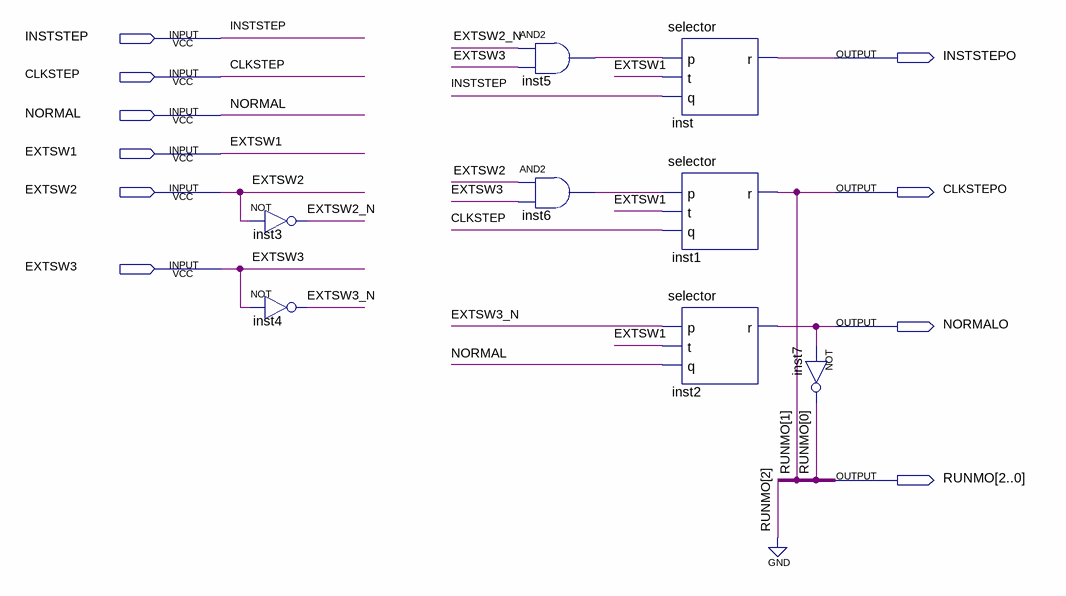
[diagram p0: schematic sheet]
// Quartus schematic runmode_ext.bdf as structural Verilog: 8 symbols, 10 pins
module runmode_ext (
  input  INSTSTEP,
  input  CLKSTEP,
  input  NORMAL,
  input  EXTSW1,
  input  EXTSW2,
  input  EXTSW3,
  output INSTSTEPO,
  output CLKSTEPO,
  output NORMALO,
  output [2:0] RUNMO
);

  wire EXTSW2_N, EXTSW3_N, inst5_out, inst6_out;

  not inst3 (EXTSW2_N, EXTSW2);
  not inst4 (EXTSW3_N, EXTSW3);
  and inst5 (inst5_out, EXTSW2_N, EXTSW3);
  and inst6 (inst6_out, EXTSW2, EXTSW3);
  selector inst (.p(inst5_out), .t(EXTSW1), .q(INSTSTEP), .r(INSTSTEPO));
  selector inst1 (.p(inst6_out), .t(EXTSW1), .q(CLKSTEP), .r(CLKSTEPO));
  selector inst2 (.p(EXTSW3_N), .t(EXTSW1), .q(NORMAL), .r(NORMALO));
  not inst7 (RUNMO[0], NORMALO);

  assign RUNMO[2:1] = {1'b0, CLKSTEPO};
endmodule
